# Altium schematic sheet PMTF_Middle_board.schdoc
size A4; Organization: Altium Limited; Address1: L3, 12a Rodborough Rd; Address2: Frenchs Forest; Address3: NSW; Address4: Australia 2086
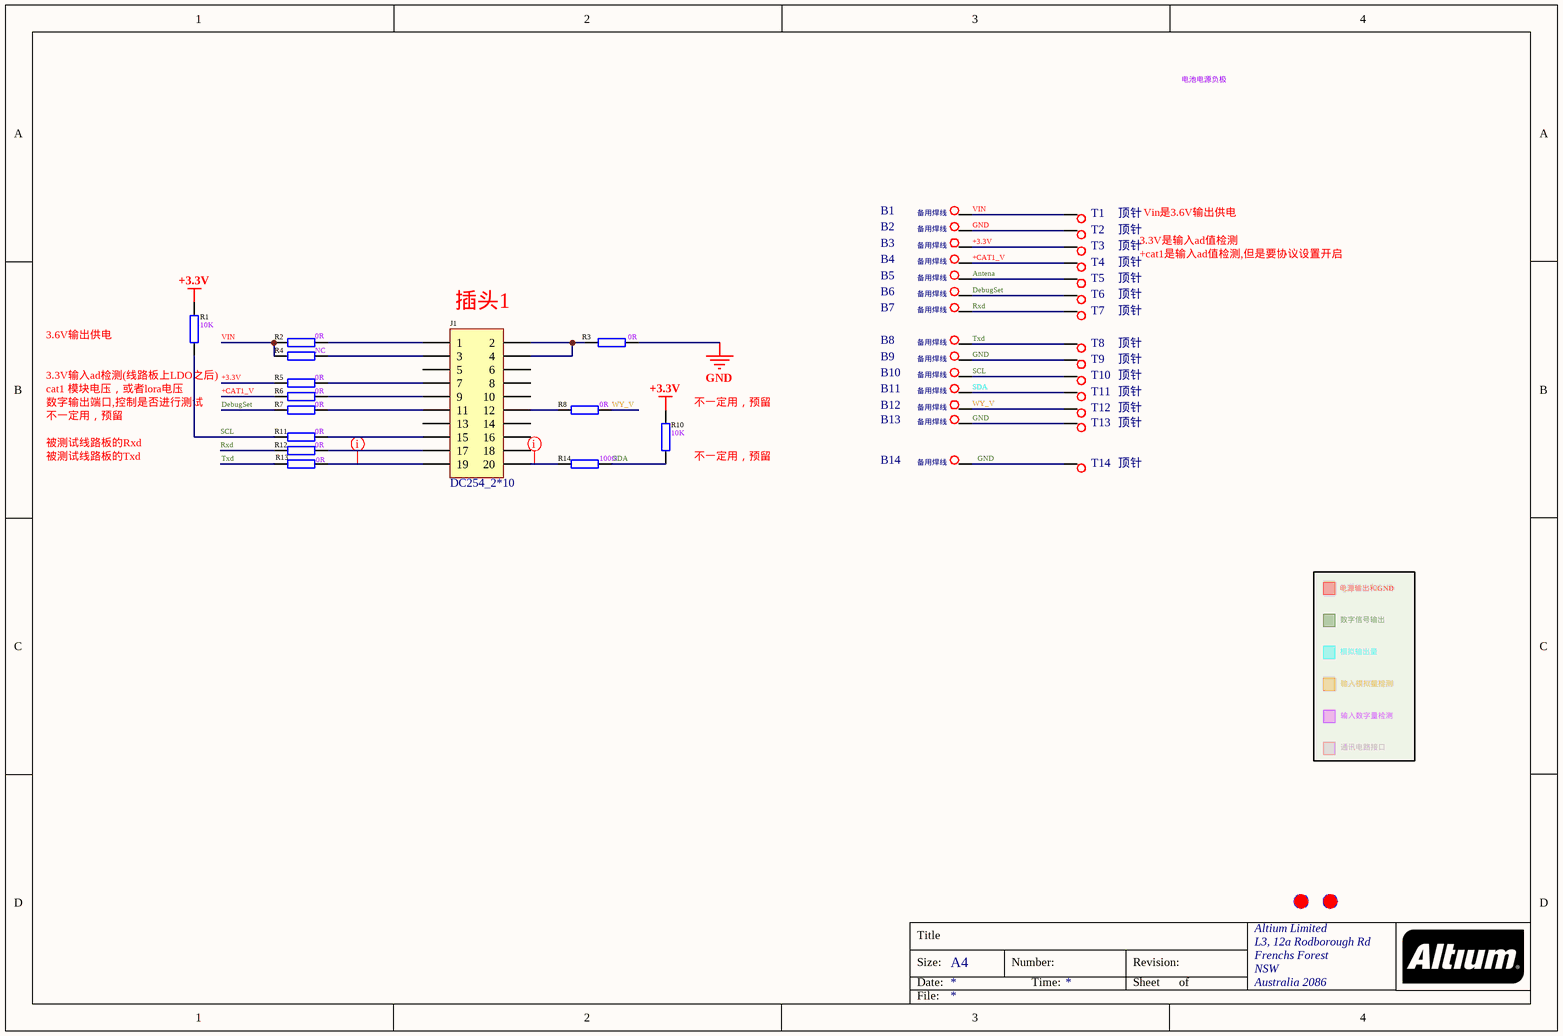
[diagram p0: PMTF_Middle_board.schdoc]

## Parts
B1  备用焊线  [TestPoint]
B2  备用焊线  [TestPoint]
B3  备用焊线  [TestPoint]
B4  备用焊线  [TestPoint]
B5  备用焊线  [TestPoint]
B6  备用焊线  [TestPoint]
B7  备用焊线  [TestPoint]
B8  备用焊线  [TestPoint]
B9  备用焊线  [TestPoint]
B10  备用焊线  [TestPoint]
B11  备用焊线  [TestPoint]
B12  备用焊线  [TestPoint]
B13  备用焊线  [TestPoint]
B14  备用焊线  [TestPoint]
J1  DC254_2*10  [IDC2.54-LI-2x10P]
M1  MARK  [MARK]  (value not drawn)
M2  MARK  [MARK]  (value not drawn)
R1  10K  [R-1206]
R2  0R  [R-1206]
R3  0R  [R-1206]
R4  NC  [R-1206]
R5  0R  [R-1206]
R6  0R  [R-1206]
R7  0R  [R-1206]
R8  0R  [R-1206]
R10  10K  [R-1206]
R11  0R  [R-1206]
R12  0R  [R-1206]
R13  0R  [R-1206]
R14  100Ω  [R-1206]
T1  顶针  [TestPoint]
T2  顶针  [TestPoint]
T3  顶针  [TestPoint]
T4  顶针  [TestPoint]
T5  顶针  [TestPoint]
T6  顶针  [TestPoint]
T7  顶针  [TestPoint]
T8  顶针  [TestPoint]
T9  顶针  [TestPoint]
T10  顶针  [TestPoint]
T11  顶针  [TestPoint]
T12  顶针  [TestPoint]
T13  顶针  [TestPoint]
T14  顶针  [TestPoint]

## Nets
+3.3V: B3.1 R1.1 R5.1 R10.1 T3.1
GND: B2.1 B9.1 B13.1 B14.1 R3.1 T2.1 T9.1 T13.1 T14.1
+CAT1_V: B4.1 R6.1 T4.1
Antena: B5.1 T5.1
DebugSet: B6.1 R7.1 T6.1
Rxd: B7.1 R12.1 T7.1
SCL: B10.1 R1.2 R11.1 T10.1
SDA: B11.1 R10.2 R14.1 T11.1
Txd: B8.1 R13.1 T8.1
VIN: B1.1 R2.1 R4.1 T1.1
WY_V: B12.1 R8.1 T12.1
NetJ1_1: J1.1 R2.2
NetJ1_2: J1.2 J1.4 R3.2
NetJ1_3: J1.3 R4.2
NetJ1_7: J1.7 R5.2
NetJ1_9: J1.9 R6.2
NetJ1_11: J1.11 R7.2
NetJ1_12: J1.12 R8.2
NetJ1_15: J1.15 R11.2
NetJ1_17: J1.17 R12.2
NetJ1_19: J1.19 R13.2
NetJ1_20: J1.20 R14.2

Not connected (* = marked no-connect by the designer): J1 5 6 8 10 13 14 16 18

## Layout directives
rule Clearance Constraint [Clearance = 23.622mil]: NetJ1_19, NetJ1_20

## Notes on the sheet
- 电池电源负极
- 3.3V是输入ad值检测
- Vin是3.6V输出供电
- (near J1) 插头1
- +cat1是输入ad值检测,但是要协议设置开启
- 3.6V输出供电
- (near R1) 3.3V输入ad检测(线路板上LDO之后)
- 数字输出端口,控制是否进行测试
- cat1 模块电压，或者lora电压
- 被测试线路板的Rxd
- 不一定用，预留
- (near R10) 不一定用，预留
- 被测试线路板的Txd
- 电源输出和GND
- 模拟输出量
- 数字信号输出
- 输入模拟量检测
- 输入数字量检测
- 通讯电路接口
- Title
- Size:
- Date:
- A4
- Number:
- Time:
- Revision:
- Sheet
- of
- File:

## Library data of the parts
B1-B14 T1-T14 = AD_WXHJ_TEST-POINT_01: 通孔测试点; Part Name: 测试点; ID: 24; SMD/DIP: SMD; Part Number: AD_WXHJ_TEST-POINT_01
J1 = 1010902-0139: DC2 2.54mm 2x10pin,2.54mm间距，2x10pin，32×8.55×27.5mm,母头,双排,双排牛角座; Part Name: DC牛角座; ID: 4; SMD/DIP: DIP; Part Number: 1010902-0139
M1 M2 = MARK: MARK点
R1-R8 R10-R14 = 101010101-0013: 0Ω,±5%,1/4W,1206,国巨,RC1206JR-070RL; Part Name: 1206贴片电阻; ID: 2; SMD/DIP: SMD; Part Number: 101010101-0013